# Altium schematic sheet Схема Wi-Fi Velvet Controller.SchDoc
size A3; SheetNumber: 4; SheetTotal: 6
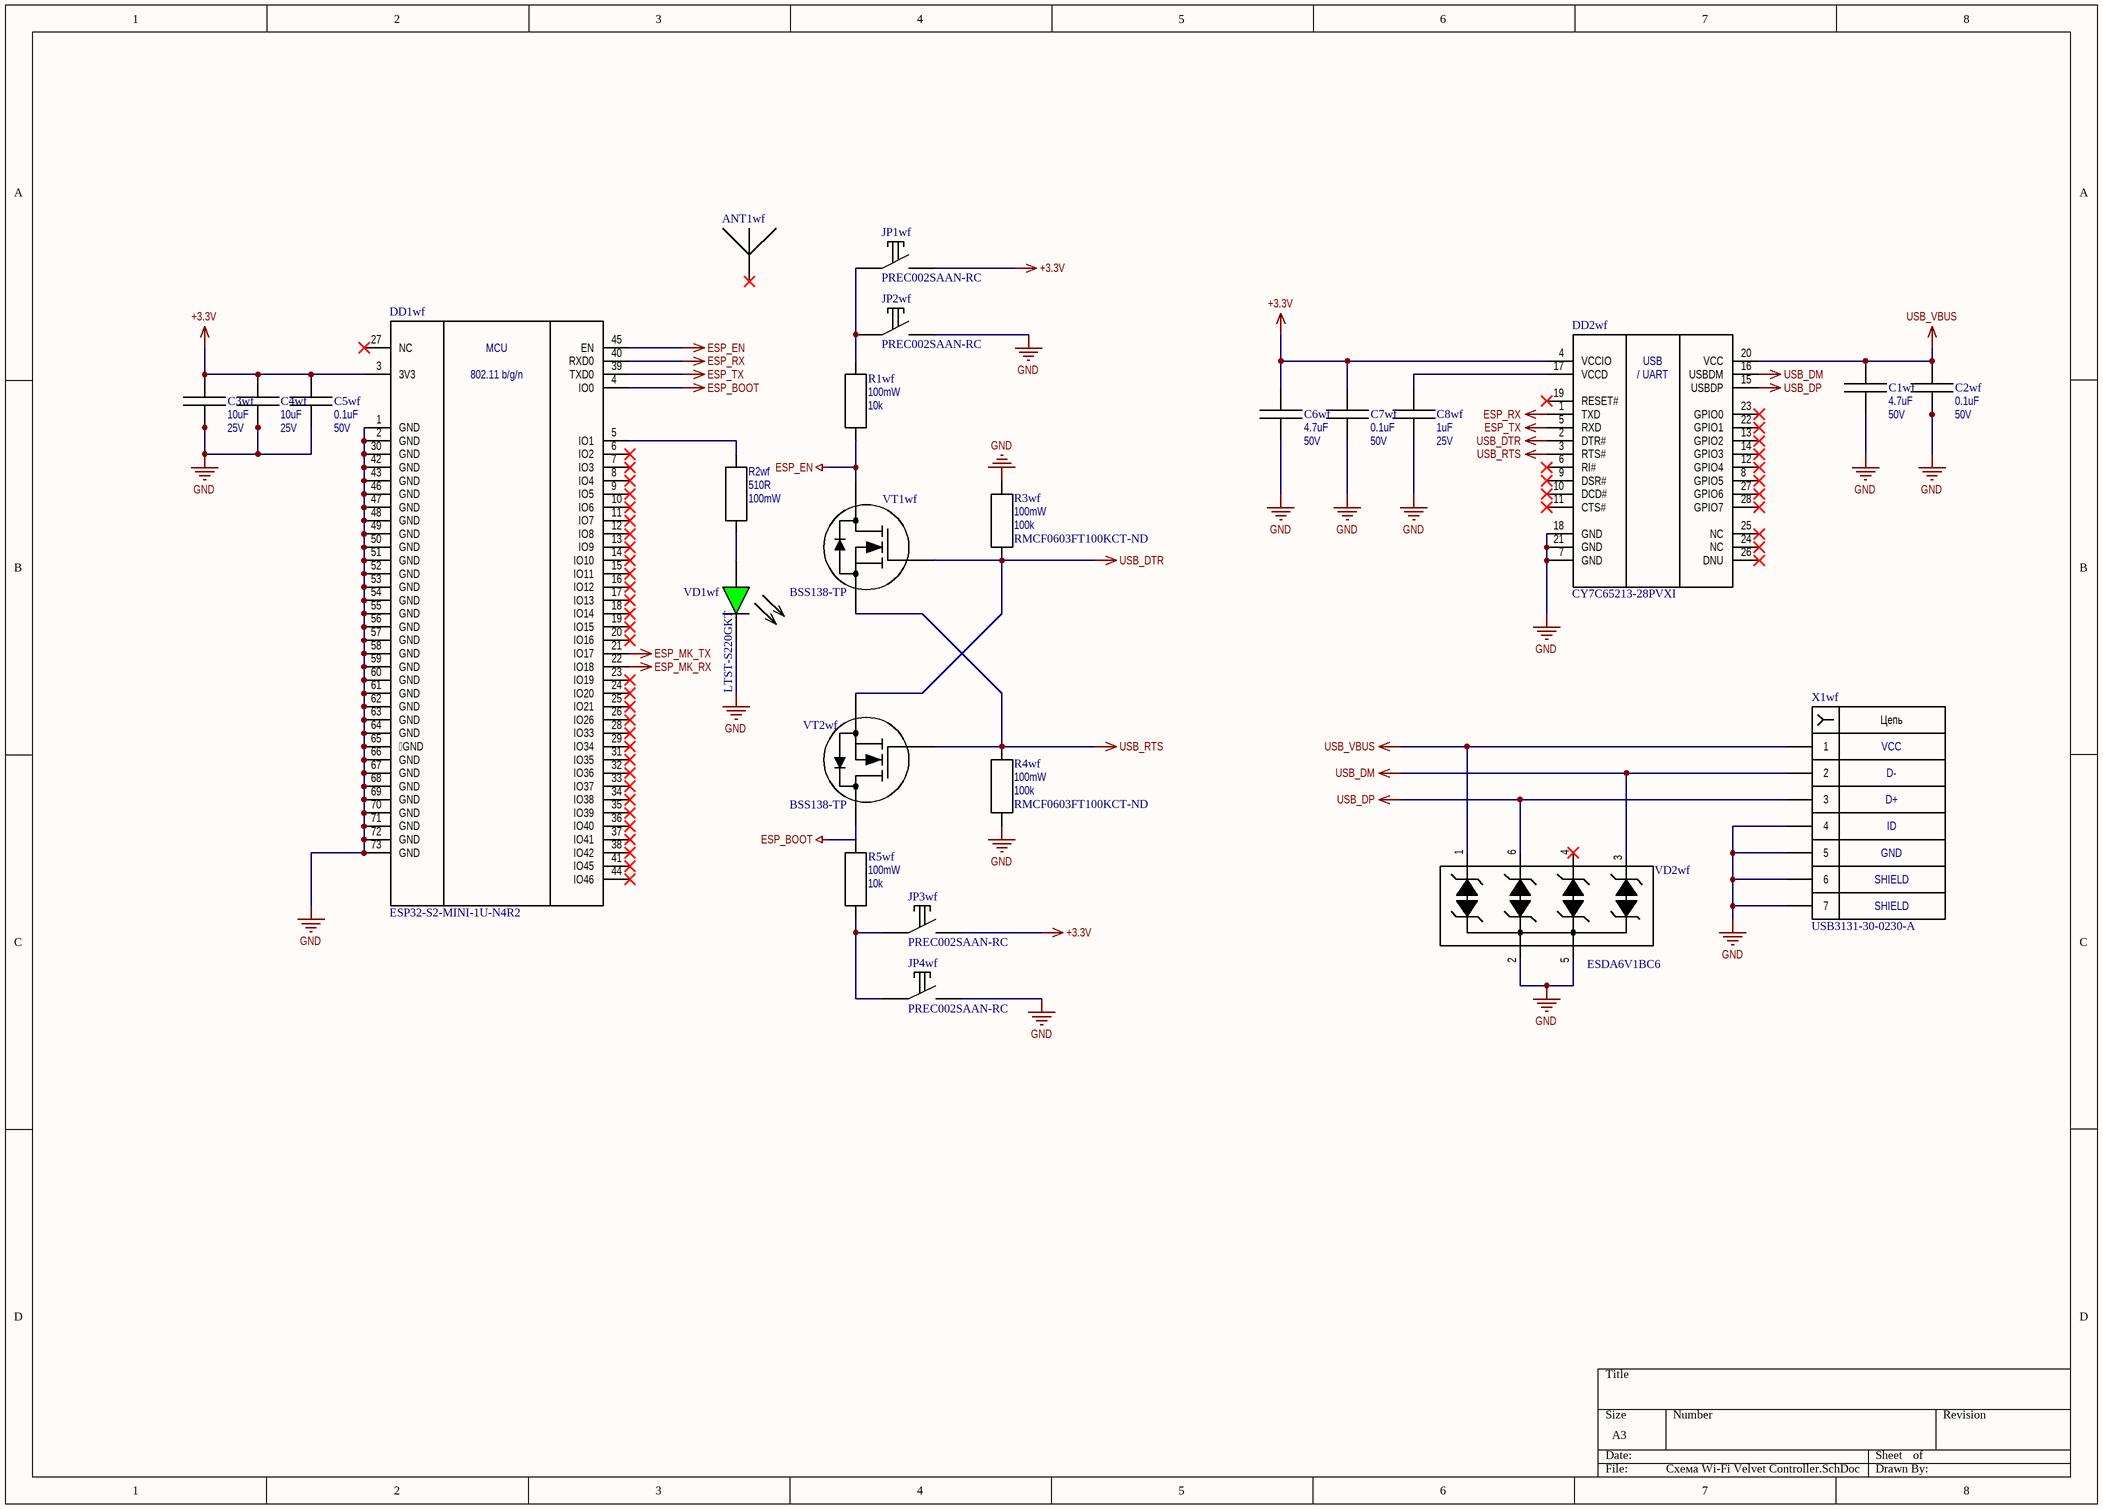
[diagram p0: Схема Wi-Fi Velvet Controller.SchDoc]

## Parts
ANT1wf  CA-DKCA0-152L0-AJI0-O  (value not drawn)  (mechanical)
C1wf  Capacitance: 4.7uF  Rated Voltage: 50V  [CAP 0805 IPC MAX]  (hidden comment: CL21A475KBQNNNE)
C2wf  Capacitance: 0.1uF  Rated Voltage: 50V  [CAP 0603 IPC MAX]  (hidden comment: GCM188R71H104KA57D)
C3wf  Capacitance: 10uF  Rated Voltage: 25V  [CAP 1206 IPC MAX]  (hidden comment: CL31B106KAHNNNE)
C4wf  Capacitance: 10uF  Rated Voltage: 25V  [CAP 1206 IPC MAX]  (hidden comment: CL31B106KAHNNNE)
C5wf  Capacitance: 0.1uF  Rated Voltage: 50V  [CAP 0603 IPC MAX]  (hidden comment: GCM188R71H104KA57D)
C6wf  Capacitance: 4.7uF  Rated Voltage: 50V  [CAP 0805 IPC MAX]  (hidden comment: CL21A475KBQNNNE)
C7wf  Capacitance: 0.1uF  Rated Voltage: 50V  [CAP 0603 IPC MAX]  (hidden comment: GCM188R71H104KA57D)
C8wf  Capacitance: 1uF  Rated Voltage: 25V  [CAP 0603 IPC MAX]  (hidden comment: TMK107BJ105KA-T)
DD1wf  ESP32-S2-MINI-1U-N4R2  [ESP32­S2­MINI­1U]
DD2wf  CY7C65213-28PVXI  [TSSOP-28]
JP1wf  PREC002SAAN-RC  [2P TH 2.54mm]
JP2wf  PREC002SAAN-RC  [2P TH 2.54mm]
JP3wf  PREC002SAAN-RC  [2P TH 2.54mm]
JP4wf  PREC002SAAN-RC  [2P TH 2.54mm]
R1wf  Power Rated: 100mW  Resistance: 10k  [RES 0603 IPC MAX]  (hidden comment: RMCF0603JT10K0)
R2wf  Resistance: 510R  Power Rating: 100mW  [RES 0603 IPC MAX]  (hidden comment: RMCF0603JT510R)
R3wf  Power Rated: 100mW  Resistance: 100k  Supplier Part Number 1: RMCF0603FT100KCT-ND  [RES 0603 IPC MAX]  (hidden comment: RMCF0603FT100K)
R4wf  Power Rated: 100mW  Resistance: 100k  Supplier Part Number 1: RMCF0603FT100KCT-ND  [RES 0603 IPC MAX]  (hidden comment: RMCF0603FT100K)
R5wf  Power Rated: 100mW  Resistance: 10k  [RES 0603 IPC MAX]  (hidden comment: RMCF0603JT10K0)
VD1wf  LTST-S220GKT  [0805 DIODE]
VD2wf  ESDA6V1BC6  [SOT-23-6]
VT1wf  BSS138-TP  [SOT-23-3]
VT2wf  BSS138-TP  [SOT-23-3]
X1wf  USB3131-30-0230-A  [USB3131-30-0230-A]

## Nets
+3.3V: C3wf.1 C4wf.1 C5wf.1 C6wf.1 C7wf.1 DD1wf.3(3V3) DD2wf.4(VCCIO) JP1wf.2 JP3wf.2
ESP_BOOT: DD1wf.4(IO0) R5wf.2 VT2wf.3(D)
ESP_EN: DD1wf.45(EN) R1wf.1 VT1wf.3(D)
ESP_MK_RX: DD1wf.22(IO18)
ESP_MK_TX: DD1wf.21(IO17)
ESP_RX: DD1wf.40(RXD0) DD2wf.1(TXD)
ESP_TX: DD1wf.39(TXD0) DD2wf.5(RXD)
GND: C1wf.2 C2wf.2 C3wf.2 C4wf.2 C5wf.2 C6wf.2 C7wf.2 C8wf.2 DD1wf.1(GND) DD1wf.2(GND) DD1wf.30(GND) DD1wf.42(GND) DD1wf.43(GND) DD1wf.46(GND) DD1wf.47(GND) DD1wf.48(GND) DD1wf.49(GND) DD1wf.50(GND) DD1wf.51(GND) DD1wf.52(GND) DD1wf.53(GND) DD1wf.54(GND) DD1wf.55(GND) DD1wf.56(GND) DD1wf.57(GND) DD1wf.58(GND) DD1wf.59(GND) DD1wf.60(GND) DD1wf.61(GND) DD1wf.62(GND) DD1wf.63(GND) DD1wf.64(GND) DD1wf.65(GND) DD1wf.66(GND) DD1wf.67(GND) DD1wf.68(GND) DD1wf.69(GND) DD1wf.70(GND) DD1wf.71(GND) DD1wf.72(GND) DD1wf.73(GND) DD2wf.7(GND) DD2wf.18(GND) DD2wf.21(GND) JP2wf.2 JP4wf.2 R3wf.2 R4wf.1 VD1wf.2 VD2wf.2 VD2wf.5 X1wf.4 X1wf.5 X1wf.6 X1wf.7
USB_DM: DD2wf.16(USBDM) VD2wf.3 X1wf.2
USB_DP: DD2wf.15(USBDP) VD2wf.6 X1wf.3
USB_DTR: DD2wf.2(DTR#) R3wf.1 VT1wf.1(G) VT2wf.2(S)
USB_RTS: DD2wf.3(RTS#) R4wf.2 VT1wf.2(S) VT2wf.1(G)
USB_VBUS: C1wf.1 C2wf.1 DD2wf.20(VCC) VD2wf.1 X1wf.1
NetC8wf_1: C8wf.1 DD2wf.17(VCCD)
NetDD1wf_5: DD1wf.5(IO1) R2wf.1
NetJP1wf_1: JP1wf.1 JP2wf.1 R1wf.2
NetJP3wf_1: JP3wf.1 JP4wf.1 R5wf.1
NetR2wf_2: R2wf.2 VD1wf.1

Not connected (* = marked no-connect by the designer): ANT1wf 1*; DD1wf 6(IO2)* 7(IO3)* 8(IO4)* 9(IO5)* 10(IO6)* 11(IO7)* 12(IO8)* 13(IO9)* 14(IO10)* 15(IO11)* 16(IO12)* 17(IO13)* 18(IO14)* 19(IO15)* 20(IO16)* 23(IO19)* 24(IO20)* 25(IO21)* 26(IO26)* 27(NC)* 28(IO33)* 29(IO34)* 31(IO35)* 32(IO36)* 33(IO37)* 34(IO38)* 35(IO39)* 36(IO40)* 37(IO41)* 38(IO42)* 41(IO45)* 44(IO46)*; DD2wf 6(RI#)* 8(GPIO5)* 9(DSR#)* 10(DCD#)* 11(CTS#)* 12(GPIO4)* 13(GPIO2)* 14(GPIO3)* 19(RESET#)* 22(GPIO1)* 23(GPIO0)* 24(NC)* 25(NC)* 26(DNU)* 27(GPIO6)* 28(GPIO7)*; VD2wf 4*

## Notes on the sheet
- (in symbol CY7C65213-28PVXI) USB; / UART
- (in symbol ESP32-S2-MINI-1U-N4R2) MCU; 802.11 b/g/n
- (in symbol USB3131-30-0230-A) Цепь; VCC; D-; D+; ID; GND; SHIELD

## Library data of the parts
ANT1wf = CA-DKCA0-152L0-AJI0-O: WATERPROOF SMA TO IPEX FOR 1.13; Manufacturer 1: Adam Tech; Style: U.FL (UMCC), IPEX MHF1 to SMA; 1st Connector: SMA Jack; 1st Contact Gender: Female; 1st Connector Mounting Type: Panel Mount; 1st Connector Mounting Feature: Bulkhead - Front Side Nut; 2nd Connector: U.FL (UMCC), IPEX MHF1 Plug, Right Angle; 2nd Connector Mounting Type: Free Hanging (In-Line); Frequency - Max: 6 GHz; Manufacturer Part Number 1: CA-DKCA0-152L0-AJI0-O; 2nd Contact Gender: Female; 2nd Connector Mounting Feature: *; Length: 152.00mm
C1wf C6wf = CL21A475KBQNNNE: CAP SMD CER 4.7UF 50V X5R 0805; Manufacturer 1: Samsung Electro-Mechanics; Tolerance: 10%; Type: Multilayer Ceramic; Manufacturer Part Number 1: CL21A475KBQNNNE; Min Operating Temperature: -55°C; Max Operating Temperature: 85°C; Mounting: SM; Package: 0805; Supplier 1: Digi-Key; Supplier Part Number 1: 1276-1248-1-ND
C2wf C5wf C7wf = GCM188R71H104KA57D: CAP SMD CER 0.1UF 50V X7R 0603; Manufacturer 1: Murata Electronics; Tolerance: 10%; Type: Multilayer Ceramic; Manufacturer Part Number 1: GCM188R71H104KA57D; Min Operating Temperature: -55°C; Max Operating Temperature: 125°C; Mounting: SM; Package: 0603; Supplier 1: Digi-Key; Supplier Part Number 1: 490-4779-1-ND
C3wf C4wf = CL31B106KAHNNNE: CAP SMD CER 10UF 25V X7R 1206; Manufacturer 1: Samsung Electro-Mechanics; Tolerance: 10%; Type: Multilayer Ceramic; Manufacturer Part Number 1: CL31B106KAHNNNE; Min Operating Temperature: -55°C; Max Operating Temperature: 125°C; Mounting: SM; Package: 1206; Supplier 1: Digi-Key; Supplier Part Number 1: 1276-1804-1-ND
C8wf = TMK107BJ105KA-T: CAP SMD CER 1UF 25V X5R 0603; Manufacturer 1: Taiyo Yuden; Tolerance: 10%; Type: Multilayer Ceramic; Manufacturer Part Number 1: TMK107BJ105KA-T; Min Operating Temperature: -55°C; Max Operating Temperature: 85°C; Mounting: SM; Package: 0603; Supplier 1: Digi-Key; Supplier Part Number 1: 587-1248-1-ND
DD1wf = ESP32-S2-MINI-1U-N4R2: SMD MODULE, ESP32-S2FN4R2 WITH WIFI 802.11B/G/N TRANCEIVER MODULE 2.4GHZ; Manufacturer 1: Espressif Systems; Data Rate: 150Mbps; Antenna Type: IPEX; Memory Size: 6MB Flash, 128kB ROM, 336kB SRAM; Supply Voltage: 3.3V; Max Supply Current: TX=310mA, RX=68mA, CPU = 32mA; Manufacturer Part Number 1: ESP32-S2-MINI-1U-N4R2; Min Operating Temperature: -40°C; Max Operating Temperature: 85°C; RF Standard: WiFi; Protocol: 802.11b/g/n; Mounting: SM; Package: 65-SMD Module; Supplier 1: Digi-Key; Supplier Part Number 1: 1965-ESP32-S2-MINI-1U-N4R2CT-ND
DD2wf = CY7C65213-28PVXI: IC USB-SERIAL PART 28SSOP; Manufacturer 1: Infineon Technologies; Function: USB to UART; Standards: USB 2.0; Supply Voltage: 1.71V ~ 5.5V; Max Supply Current: 20mA; Manufacturer Part Number 1: CY7C65213-28PVXI; Min Operating Temperature: -40°C; Max Operating Temperature: 85°C; Package: 28-SSOP; Mounting: *
JP1wf JP2wf JP3wf JP4wf = PREC002SAAN-RC: CONN HEADER VERT 2POS 2.54MM; Manufacturer 1: Sullins Connector Solutions; Manufacturer Part Number 1: PREC002SAAN-RC; Number of Pins: 2; Pitch: 2.54mm
R1wf R5wf = RMCF0603JT10K0: RES SMD 10K OHM 5% 1/10W 0603; Manufacturer 1: Stackpole Electronics Inc; Voltage Rated: 75V; Manufacturer Part Number 1: RMCF0603JT10K0; Min Operating Temperature: -55°C; Max Operating Temperature: 155°C; Tolerance: 5%; Package: 0603; Ratings: AEC-Q200; Supplier 1: Digi-Key; Supplier Part Number 1: RMCF0603JT10K0CT-ND
R2wf = RES GOST: RES 510 OHM 5% 1/10W 0603; Manufacturer 1: Stackpole Electronics Inc; Manufacturer Part Number 1: RMCF0603JT510R; Tolerance: 5%; Min Operating Temperature: -55°C; Max Operating Temperature: 155°C; Package: 0603
R3wf R4wf = RMCF0603FT100K: RES SMD 100K OHM 5% 1/10W 0603; Manufacturer 1: Stackpole Electronics Inc; Voltage Rated: 75V; Manufacturer Part Number 1: RMCF0603FT100K; Min Operating Temperature: -55°C; Max Operating Temperature: 155°C; Tolerance: 5%; Package: 0603; Ratings: AEC-Q200; Supplier 1: Digi-Key
VD1wf = LTST-S220GKT: LED GREEN CLEAR SMD R/A; Manufacturer 1: Lite-On Inc.; Max Continious Current: 30mA; Max Pulse Current: 120mA; Reverse Voltage: 5V; Power Dissipation: 100mW; Forward Voltage: 2.2V; Manufacturer Part Number 1: LTST-S220GKT; Max Operating Temperature: +85°C; Package: 0805
VD2wf = ESDA6V1BC6: TVS DIODE 5VWM SOT23-6; Manufacturer 1: STMicroelectronics; Voltage - Reverse Standoff (Typ): 5V; Voltage - Breakdown (Min): 6.1V; Type: Biderectional; Number Of Chanels: 4; Max Pulse Power: 80W; Manufacturer Part Number 1: ESDA6V1BC6; Mounting: SM; Max Operating Temperature: 125°C; Min Operating Temperature: -40°C; Package: SOT-23-6
VT1wf VT2wf = BSS138-TP: MOSFET N-CH 50V 220MA SOT23; Manufacturer 1: Micro Commercial Co; Type: P-Chanel; Rds On (Max): 3.5Ohm; Vth: 1.5V; Gate Charge: 1.65nC; Vgs Max: 20V; Input Capacitance: 60pF; Max Power Dissipation: 350mW; Vds Max: 50V; Max Drain Current: 220mA; Min Operating Temperature: -55°C; Max Operating Temperature: 150°C; Mounting Type: SM; Package: SOT-23; Manufacturer Part Number 1: BSS138-TP; Supplier 1: Digi-Key; Supplier Part Number 1: BSS138-TPMSCT-ND
X1wf = USB3131-30-0230-A: MICRO B SKT, VERTICAL, TH, 30",; Manufacturer 1: GCT; Specifications: USB 2.0; Gender: Receptacle; Connector Type: USB - micro B; Current Rating (Amps): 1A; Number of Ports: 1; Voltage - Rated: 30V; Manufacturer Part Number 1: USB3131-30-0230-A; Min Operating Temperature: -55°C; Max Operating Temperature: 85°C; Mounting: T/H; Mounting Feature: Vertical